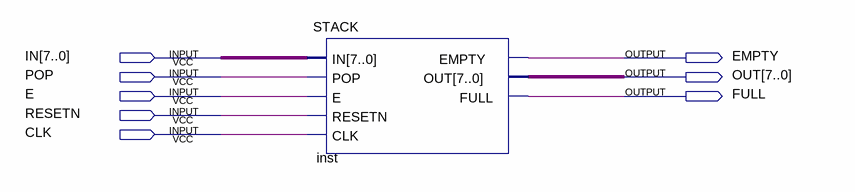
[diagram p0: schematic sheet]
// Quartus schematic TOP.bdf as structural Verilog: 1 symbols, 8 pins
module TOP (
  input  [7:0] IN,
  input  POP,
  input  E,
  input  RESETN,
  input  CLK,
  output EMPTY,
  output [7:0] OUT,
  output FULL
);

  STACK inst (.IN(IN), .POP(POP), .E(E), .RESETN(RESETN), .CLK(CLK), .EMPTY(EMPTY), .OUT(OUT), .FULL(FULL));
endmodule
